# EAGLE schematic CR123aBoost (EAGLE 5.10)
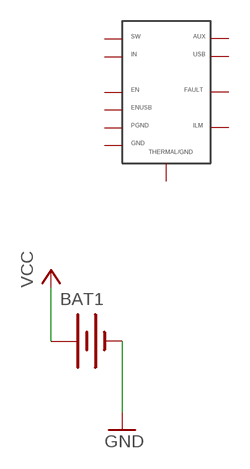
[diagram p0: schematic, sheet 1]

## Parts
BAT1  BATTERYCR123A  [BATTERY_CR123A]
U$1  TPS2500SON10  [SON-10]

## Nets
GND: BAT1.-
VCC: BAT1.+
Unconnected: U$1.1(SW) U$1.2(PGND) U$1.3(IN) U$1.4(EN) U$1.5(GND) U$1.6(ILM) U$1.7(ENUSB) U$1.8(FAULT) U$1.9(USB) U$1.10(AUX) U$1.TH

## Library data of the parts
BAT1 = tvbgone-adj:BATTERY: Battery Holders Various common sizes : AA, AAA, 20mm coin cell and 12mm coin cell.
U$1 = CR123aBoost:TPS2500